# EAGLE schematic tmc2209 (EAGLE 7.3.0)
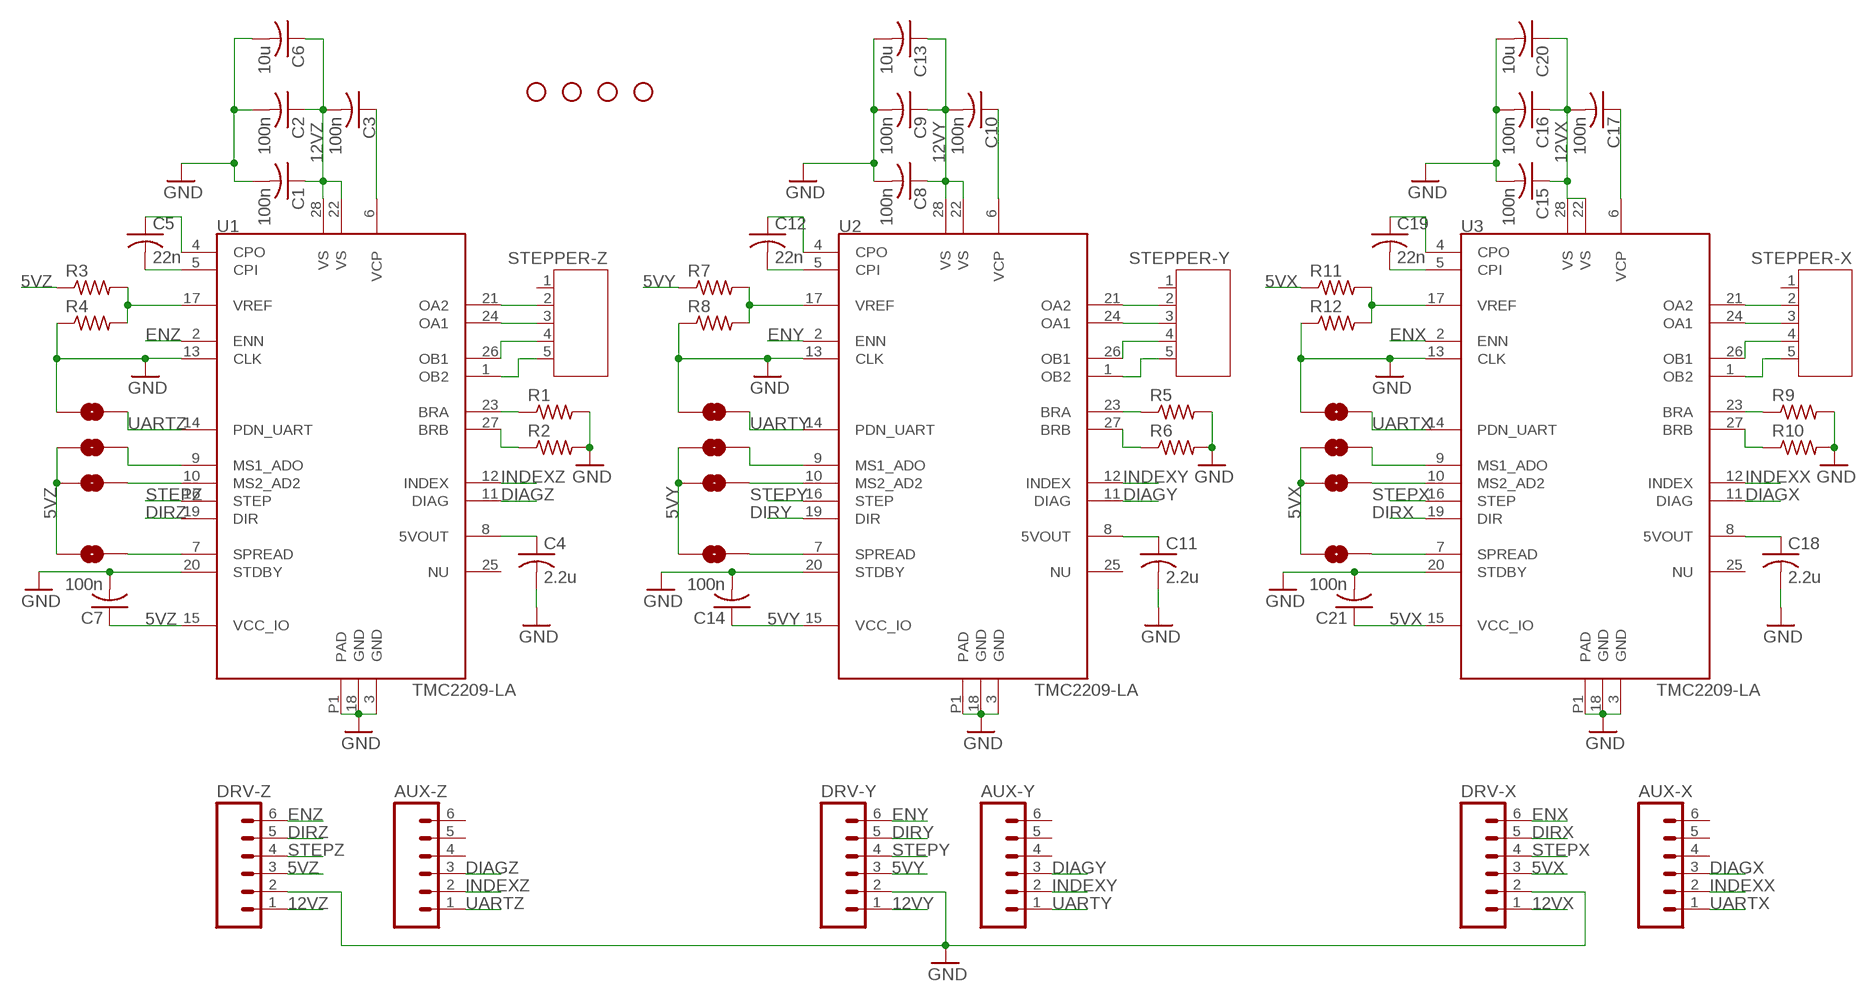
[diagram p0: schematic, sheet 1]

## Parts
AUX-X  M06LOCK  [1X06_LOCK]
AUX-Y  M06LOCK  [1X06_LOCK]
AUX-Z  M06LOCK  [1X06_LOCK]
C1  100n  C-USC0603  [C0603]
C2  100n  C-USC0603  [C0603]
C3  100n  C-USC0603  [C0603]
C4  2.2u  C-USC1206  [C1206]
C5  22n  C-USC0603  [C0603]
C6  10u  C-USC1206  [C1206]
C7  100n  C-USC0603  [C0603]
C8  100n  C-USC0603  [C0603]
C9  100n  C-USC0603  [C0603]
C10  100n  C-USC0603  [C0603]
C11  2.2u  C-USC1206  [C1206]
C12  22n  C-USC0603  [C0603]
C13  10u  C-USC1206  [C1206]
C14  100n  C-USC0603  [C0603]
C15  100n  C-USC0603  [C0603]
C16  100n  C-USC0603  [C0603]
C17  100n  C-USC0603  [C0603]
C18  2.2u  C-USC1206  [C1206]
C19  22n  C-USC0603  [C0603]
C20  10u  C-USC1206  [C1206]
C21  100n  C-USC0603  [C0603]
DRV-X  M06LOCK  [1X06_LOCK]
DRV-Y  M06LOCK  [1X06_LOCK]
DRV-Z  M06LOCK  [1X06_LOCK]
PDX  SOLDERJUMPERNO  [SJ_2S-NO]
PDY  SOLDERJUMPERNO  [SJ_2S-NO]
PDZ  SOLDERJUMPERNO  [SJ_2S-NO]
R1  R-US_R0805  [R0805]
R2  R-US_R0805  [R0805]
R3  R-US_R0603  [R0603]
R4  R-US_R0603  [R0603]
R5  R-US_R0805  [R0805]
R6  R-US_R0805  [R0805]
R7  R-US_R0603  [R0603]
R8  R-US_R0603  [R0603]
R9  R-US_R0805  [R0805]
R10  R-US_R0805  [R0805]
R11  R-US_R0603  [R0603]
R12  R-US_R0603  [R0603]
SJ2  SOLDERJUMPERNO  [SJ_2S-NO]
SJ3  SOLDERJUMPERNO  [SJ_2S-NO]
SJ5  SOLDERJUMPERNO  [SJ_2S-NO]
SJ6  SOLDERJUMPERNO  [SJ_2S-NO]
SJ8  SOLDERJUMPERNO  [SJ_2S-NO]
SJ9  SOLDERJUMPERNO  [SJ_2S-NO]
SJ10  SOLDERJUMPERNO  [SJ_2S-NO]
SJ11  SOLDERJUMPERNO  [SJ_2S-NO]
SJ12  SOLDERJUMPERNO  [SJ_2S-NO]
STANDOFF1  STAND-OFFTIGHT  [STAND-OFF-TIGHT]
STANDOFF2  STAND-OFFTIGHT  [STAND-OFF-TIGHT]
STANDOFF3  STAND-OFFTIGHT  [STAND-OFF-TIGHT]
STANDOFF4  STAND-OFFTIGHT  [STAND-OFF-TIGHT]
STEPPER-X  JST-PH5  [JST-PH5]
STEPPER-Y  JST-PH5  [JST-PH5]
STEPPER-Z  JST-PH5  [JST-PH5]
U1  TMC2209-LA  [QFN28-5X5-XLEP]
U2  TMC2209-LA  [QFN28-5X5-XLEP]
U3  TMC2209-LA  [QFN28-5X5-XLEP]

## Nets
5VX: C21.1 DRV-X.3 R11.1 SJ8.1 SJ9.1 SJ12.1 U3.15(VCC_IO)
5VY: C14.1 DRV-Y.3 R7.1 SJ5.1 SJ6.1 SJ11.1 U2.15(VCC_IO)
5VZ: C7.1 DRV-Z.3 R3.1 SJ2.1 SJ3.1 SJ10.1 U1.15(VCC_IO)
12VX: C15.1 C16.1 C17.2 C20.1 DRV-X.1 U3.22(VS) U3.28(VS)
12VY: C8.1 C9.1 C10.2 C13.1 DRV-Y.1 U2.22(VS) U2.28(VS)
12VZ: C1.1 C2.1 C3.2 C6.1 DRV-Z.1 U1.22(VS) U1.28(VS)
DIAGX: AUX-X.3 U3.11(DIAG)
DIAGY: AUX-Y.3 U2.11(DIAG)
DIAGZ: AUX-Z.3 U1.11(DIAG)
DIRX: DRV-X.5 U3.19(DIR)
DIRY: DRV-Y.5 U2.19(DIR)
DIRZ: DRV-Z.5 U1.19(DIR)
ENX: DRV-X.6 U3.2(ENN)
ENY: DRV-Y.6 U2.2(ENN)
ENZ: DRV-Z.6 U1.2(ENN)
GND: C1.2 C2.2 C4.2 C6.2 C7.2 C8.2 C9.2 C11.2 C13.2 C14.2 C15.2 C16.2 C18.2 C20.2 C21.2 DRV-X.2 DRV-Y.2 DRV-Z.2 PDX.1 PDY.1 PDZ.1 R1.2 R2.2 R4.1 R5.2 R6.2 R8.1 R9.2 R10.2 R12.1 U1.3(GND) U1.13(CLK) U1.18(GND) U1.20(STDBY) U1.P1(PAD) U2.3(GND) U2.13(CLK) U2.18(GND) U2.20(STDBY) U2.P1(PAD) U3.3(GND) U3.13(CLK) U3.18(GND) U3.20(STDBY) U3.P1(PAD)
INDEXX: AUX-X.2 U3.12(INDEX)
INDEXY: AUX-Y.2 U2.12(INDEX)
INDEXZ: AUX-Z.2 U1.12(INDEX)
N$1: STEPPER-Z.5 U1.1(OB2)
N$2: STEPPER-Z.4 U1.26(OB1)
N$3: STEPPER-Z.3 U1.24(OA1)
N$4: STEPPER-Z.2 U1.21(OA2)
N$5: STEPPER-Y.5 U2.1(OB2)
N$6: STEPPER-Y.4 U2.26(OB1)
N$7: STEPPER-Y.3 U2.24(OA1)
N$8: STEPPER-Y.2 U2.21(OA2)
N$9: STEPPER-X.2 U3.21(OA2)
N$10: STEPPER-X.3 U3.24(OA1)
N$11: STEPPER-X.4 U3.26(OB1)
N$12: STEPPER-X.5 U3.1(OB2)
N$13: R5.1 U2.23(BRA)
N$14: C11.1 U2.8(5VOUT)
N$15: SJ2.2 U1.9(MS1_ADO)
N$16: SJ3.2 U1.10(MS2_AD2)
N$17: SJ6.2 U2.10(MS2_AD2)
N$18: R6.1 U2.27(BRB)
N$19: C18.1 U3.8(5VOUT)
N$20: C17.1 U3.6(VCP)
N$22: C12.2 U2.5(CPI)
N$23: C12.1 U2.4(CPO)
N$24: C19.2 U3.5(CPI)
N$25: SJ5.2 U2.9(MS1_ADO)
N$26: C19.1 U3.4(CPO)
N$27: SJ12.2 U3.7(SPREAD)
N$28: SJ11.2 U2.7(SPREAD)
N$29: SJ9.2 U3.10(MS2_AD2)
N$30: SJ8.2 U3.9(MS1_ADO)
N$31: R11.2 R12.2 U3.17(VREF)
N$32: R7.2 R8.2 U2.17(VREF)
N$34: C10.1 U2.6(VCP)
N$40: SJ10.2 U1.7(SPREAD)
N$51: R9.1 U3.23(BRA)
N$52: R10.1 U3.27(BRB)
N$53: R1.1 U1.23(BRA)
N$54: R2.1 U1.27(BRB)
N$55: R3.2 R4.2 U1.17(VREF)
N$56: C4.1 U1.8(5VOUT)
N$57: C5.2 U1.5(CPI)
N$58: C5.1 U1.4(CPO)
N$59: C3.1 U1.6(VCP)
STEPX: DRV-X.4 U3.16(STEP)
STEPY: DRV-Y.4 U2.16(STEP)
STEPZ: DRV-Z.4 U1.16(STEP)
UARTX: AUX-X.1 PDX.2 U3.14(PDN_UART)
UARTY: AUX-Y.1 PDY.2 U2.14(PDN_UART)
UARTZ: AUX-Z.1 PDZ.2 U1.14(PDN_UART)
Unconnected: AUX-X.4 AUX-X.5 AUX-X.6 AUX-Y.4 AUX-Y.5 AUX-Y.6 AUX-Z.4 AUX-Z.5 AUX-Z.6 STEPPER-X.1 STEPPER-Y.1 STEPPER-Z.1 U1.25(NU) U2.25(NU) U3.25(NU)

## Library data of the parts
AUX-X AUX-Y AUX-Z DRV-X DRV-Y DRV-Z = SparkFun-Connectors:M06: Header 6 Standard 6-pin 0.1" header. Use with straight break away headers (SKU : PRT-00116), right angle break away headers (PRT-00553), swiss pins (PRT-00743), machine pins (PRT-00117), and female headers (PRT-00115). Molex polarized connector foot print use with SKU : PRT-08094 with associated crimp pins and housings. NOTES ON THE VARIANTS LOCK and LOCK_LONGPADS... This footprint was designed to help hold the alignment of a through-hole component (i.e. 6-pin header) while soldering it into place. You may notice that each hole has been shifted either up or down by 0.005 of an inch from it's more standard position (which is a perfectly straight line). This slight alteration caused the pins (the squares in the middle) to touch the edges of the holes. Because they are alternating, it causes a "brace" to hold the component in place. 0.005 has proven to be the perfect amount of "off-center" position when using our standard breakaway headers. Although looks a little odd when you look at the bare footprint, once you have a header in there, the alteration is very hard to notice. Also,if you push a header all the way into place, it is covered up entirely on the bottom side. This idea of altering the position of holes to aid alignment will be further integrated into the Sparkfun Library for other footprints. It can help hold any component with 3 or more connection pins.
C1-C21 = adafruit:C-US: CAPACITOR, American symbol
PDX PDY PDZ SJ2 SJ3 SJ5 SJ6 SJ8-SJ12 = SparkFun-Retired:SOLDERJUMPER: Solder Jumper Standard SMD solder jumper. Used to automate production. Two varients : Normally Open and Normally Closed are the same, but have different paste layers. NC will have a large amount of paste and should jumper during reflow.
R1-R12 = adafruit:R-US_: RESISTOR, American symbol
STANDOFF1-STANDOFF4 = SparkFun-Electromechanical:STAND-OFF: #4 Stand Off This is the mechanical footprint for a #4 phillips button head screw. Use the keepout ring to avoid running the screw head into surrounding components. SKU : PRT-00447
STEPPER-X STEPPER-Y STEPPER-Z = jst-ph:JST-PH5
U1-U3 = borkedlabs-powerics:TMC2209; MPN: TMC2209-LA; PACKAGE: QFN28-5x5